# Altium schematic sheet Flight_Controller2.SchDoc: Sensorless BLDC Controller
size A3; PageSetup: Record=PageOptions|CenterHorizontal=True|CenterVertical=True|PrintScale=0.34|XCorrection=1.00|YCorrection=1.00|PrintKind=1|BorderSize=5000000|LeftOffset=0|BottomOffset=0|Orientation=2|PaperLength=1000|PaperWidth=1000|Scale=100|PaperSource=7|PrintQuality=-3|MediaType=1|DitherType=10|PrintScaleMode=1|PaperKind=A3|PaperIndex=8
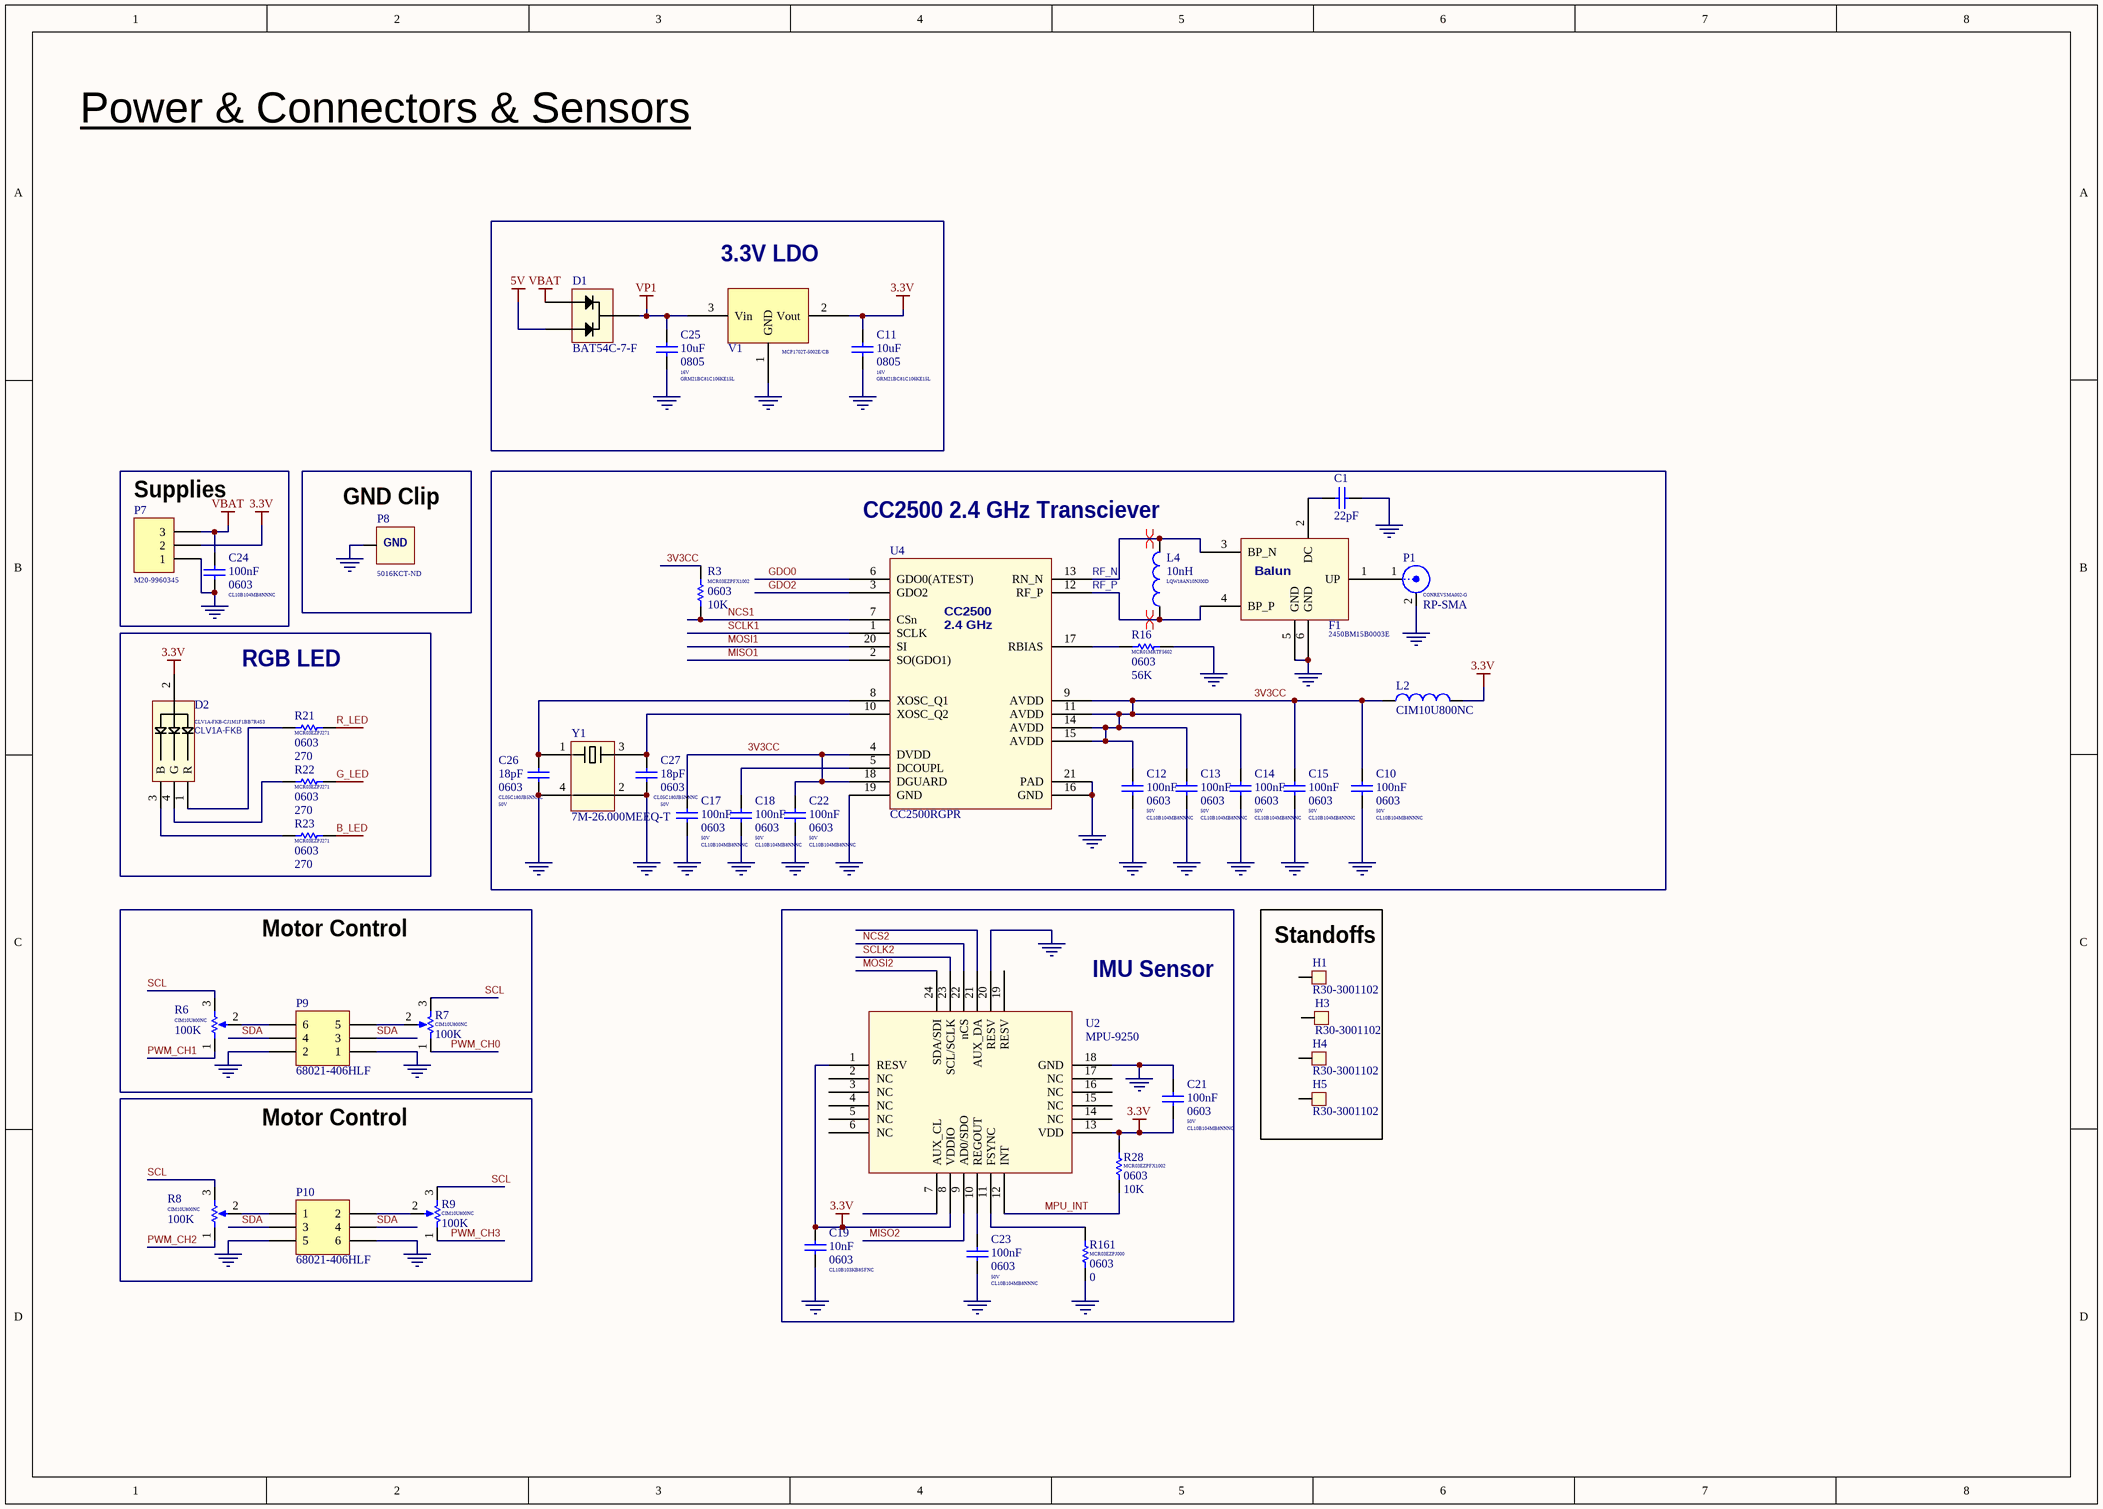
[diagram p0: Flight_Controller2.SchDoc]

## Parts
C1  value 22pF  [1608[0603]C]  (hidden comment: GRM1885C1H220FA01D)
C10  CL10B104MB8NNNC  value 100nF  PackageReference: 0603  Voltage: 50V  [1608[0603]C]
C11  GRM21BC81C106KE15L  value 10uF  PackageReference: 0805  Voltage: 16V  [6-0805_MC]
C12  CL10B104MB8NNNC  value 100nF  PackageReference: 0603  Voltage: 50V  [1608[0603]C]
C13  CL10B104MB8NNNC  value 100nF  PackageReference: 0603  Voltage: 50V  [1608[0603]C]
C14  CL10B104MB8NNNC  value 100nF  PackageReference: 0603  Voltage: 50V  [1608[0603]C]
C15  CL10B104MB8NNNC  value 100nF  PackageReference: 0603  Voltage: 50V  [1608[0603]C]
C17  CL10B104MB8NNNC  value 100nF  PackageReference: 0603  Voltage: 50V  [1608[0603]C]
C18  CL10B104MB8NNNC  value 100nF  PackageReference: 0603  Voltage: 50V  [1608[0603]C]
C19  CL10B103KB8SFNC  value 10nF  PackageReference: 0603  [1608[0603]C]
C21  CL10B104MB8NNNC  value 100nF  PackageReference: 0603  Voltage: 50V  [1608[0603]C]
C22  CL10B104MB8NNNC  value 100nF  PackageReference: 0603  Voltage: 50V  [1608[0603]C]
C23  CL10B104MB8NNNC  value 100nF  PackageReference: 0603  Voltage: 50V  [1608[0603]C]
C24  CL10B104MB8NNNC  value 100nF  PackageReference: 0603  [1608[0603]C]
C25  GRM21BC81C106KE15L  value 10uF  PackageReference: 0805  Voltage: 16V  [6-0805_MC]
C26  CL05C180JB5NNNC  value 18pF  PackageReference: 0603  Voltage: 50V  [1608[0603]C]
C27  CL05C180JB5NNNC  value 18pF  PackageReference: 0603  Voltage: 50V  [1608[0603]C]
D1  BAT54C-7-F  [SOT-23B_M_3D]
D2  CLV1A-FKB-CJ1M1F1BB7R4S3  [CLV1A-FKB_RGB_3D]
F1  2450BM15B0003E  [Balun]
H1  R30-3001102  [M3_Standoff_3]
H3  R30-3001102  [M3_Standoff_3]
H4  R30-3001102  [M3_Standoff_3]
H5  R30-3001102  [M3_Standoff_3]
L2  CIM10U800NC  [1608[0603]L]
L4  LQW18AN10NJ00D  value 10nH  [1608[0603]L]
P1  CONREVSMA002-G  SMA: RP-SMA  [SMA1]
P7  M20-9960345  [HDR1X3]
P8  5016KCT-ND  [GND_CLIP3]
P9  68021-406HLF  [HDR2X3_3D2]
P10  68021-406HLF  [HDR2X3_3D2]
R3  MCR03EZPFX1002  value 10K  PackageReference: 0603  [1608[0603]R]
R6  CIM10U800NC  value 100K  [1608[0603]TRI]
R7  CIM10U800NC  value 100K  [1608[0603]TRI]
R8  CIM10U800NC  value 100K  [1608[0603]TRI]
R9  CIM10U800NC  value 100K  [1608[0603]TRI]
R16  MCR01MRTF5602  value 56K  PackageReference: 0603  [1608[0603]R]
R21  MCR03EZPJ271  value 270  PackageReference: 0603  [1608[0603]R]
R22  MCR03EZPJ271  value 270  PackageReference: 0603  [1608[0603]R]
R23  MCR03EZPJ271  value 270  PackageReference: 0603  [1608[0603]R]
R28  MCR03EZPFX1002  value 10K  PackageReference: 0603  [1608[0603]R]
R161  MCR03EZPJ000  value 0  PackageReference: 0603  [1608[0603]R]
U2  MPU-9250  [QFN-24/3MM]
U4  CC2500RGPR  [QFN50P400X400-20VM]
V1  MCP1702T-5002E/CB  [SOT-23B_M_3D]
Y1  7M-26.000MEEQ-T  [3225_Crystal]

## Blocks framed on the sheet
3.3V LDO: C11 C25 D1 V1
Supplies: C24 P7
GND Clip: P8
CC2500 2.4 GHz Transciever: C1 C10 C12-C15 C17 C18 C22 C26 C27 F1 L2 L4 P1 R3 R16 U4 Y1
RGB LED: D2 R21-R23
Motor Control: P9 R6 R7
IMU Sensor: C19 C21 C23 R28 R161 U2
Standoffs: H1 H3-H5
Motor Control: P10 R8 R9

## Nets
3.3V: C11.2 C19.2 C21.1 D2.2(V+) L2.1 P7.2 R28.2 U2.1(RESV) U2.8(VDDIO) U2.13(VDD) V1.2(Vout)
5V: D1.2
GND: C1.2 C10.1 C11.1 C12.1 C13.1 C14.1 C15.1 C17.1 C18.1 C19.1 C21.2 C22.1 C23.1 C24.1 C25.1 C26.1 C27.1 F1.5(GND) F1.6(GND) P1.2(Y) P7.1 P8.1(GND) P9.1 P9.2 P10.5 P10.6 R16.1 R161.2 U2.18(GND) U2.20(RESV) U4.16(GND) U4.19(GND) U4.21(PAD) V1.1(GND) Y1.2(GND) Y1.4(GND)
VBAT: C24.2 D1.1 P7.3
VP1: C25.2 D1.3 V1.3(Vin)
3V3CC: C10.2 C12.2 C13.2 C14.2 C15.2 C17.2 C22.2 L2.2 R3.2 U4.4(DVDD) U4.9(AVDD) U4.11(AVDD) U4.14(AVDD) U4.15(AVDD) U4.18(DGUARD)
B_LED: R23.2
G_LED: R22.2
GDO0: U4.6(GDO0(ATEST))
GDO2: U4.3(GDO2)
MISO1: U4.2(SO(GDO1))
MISO2: U2.9(AD0/SDO)
MOSI1: U4.20(SI)
MOSI2: U2.24(SDA/SDI)
MPU_INT: R28.1 U2.12(INT)
NCS1: R3.1 U4.7(CSn)
NCS2: U2.22(nCS)
PWM_CH0: R7.1
PWM_CH1: R6.1
PWM_CH2: R8.1
PWM_CH3: R9.1
R_LED: R21.2
RF_N: F1.3(BP_N) L4.1 U4.13(RN_N)
RF_P: F1.4(BP_P) L4.2 U4.12(RF_P)
SCL: R6.3 R7.3 R8.3 R9.3
SCLK1: U4.1(SCLK)
SCLK2: U2.23(SCL/SCLK)
SDA: P9.3 P9.4 P10.3 P10.4
NetC1_1: C1.1 F1.2(DC)
NetC18_2: C18.2 U4.5(DCOUPL)
NetC23_2: C23.2 U2.10(REGOUT)
NetC26_2: C26.2 U4.8(XOSC_Q1) Y1.1(X1)
NetC27_2: C27.2 U4.10(XOSC_Q2) Y1.3(X2)
NetD2_1: D2.1(R) R21.1
NetD2_3: D2.3(B) R23.1
NetD2_4: D2.4(G) R22.1
NetF1_1: F1.1(UP) P1.1(X)
NetP9_5: P9.5 R7.2
NetP9_6: P9.6 R6.2
NetP10_1: P10.1 R8.2
NetP10_2: P10.2 R9.2
NetR16_2: R16.2 U4.17(RBIAS)
NetR161_1: R161.1 U2.11(FSYNC)

Not connected (* = marked no-connect by the designer): H1 1(0); H3 1(0); H4 1(0); H5 1(0); U2 2(NC) 3(NC) 4(NC) 5(NC) 6(NC) 7(AUX_CL) 14(NC) 15(NC) 16(NC) 17(NC) 19(RESV) 21(AUX_DA)

## Layout directives
differential pair: RF_N, RF_P

## Notes on the sheet
- Power & Connectors & Sensors
- (in symbol BALUN_2_4_GHZ) Balun
- (in symbol CC2500_2_4_ghz) CC2500; 2.4 GHz
- (in symbol RGB_LED_SMT) CLV1A-FKB

## Library data of the parts
C1 = Cap Semi: Capacitor (Semiconductor SIM Model); Published: 8-Jun-2000; LatestRevisionDate: 29-May-2009; LatestRevisionNote: IPC-7351 Footprint Added.; PackageReference: C1206; Publisher: Altium Limited; PackageDescription: Chip Capacitor; Digikey: 311-1361-1-ND
C10 C12-C15 C17 C18 C21-C24 = Cap Semi: Capacitor (Semiconductor SIM Model); PP1: 0.01210; Page: PowerInput; PackageDescription: Chip Capacitor; Digikey: 311-1361-1-ND; Part_Number: CL10B104MB8NNNC; PP100: 0.01210
C11 C25 = Cap Semi: Capacitor (Semiconductor SIM Model); Part_Number: CL10B104MB8NNNC; PP1: 0.20000; PP100: 0.06560; Page: Ethernet; PackageDescription: Chip Capacitor; Digikey: 311-1361-1-ND; ClassName: ETH_2; EXT: EXT
C19 = Cap Semi: Capacitor (Semiconductor SIM Model); PP100: 0.00910; Page: Analog; Published: 8-Jun-2000; LatestRevisionDate: 29-May-2009; LatestRevisionNote: IPC-7351 Footprint Added.; Publisher: Altium Limited; PackageDescription: Chip Capacitor; Digikey: 311-1361-1-ND; PP1: 0.00910; ClassName: AI_5
C26 C27 = Cap Semi: Capacitor (Semiconductor SIM Model); PP1: 0.00610; Page: Micro; PackageDescription: Chip Capacitor; Digikey: 311-1361-1-ND; PP100: 0.00610
D1 = Bat45C
D2 = RGB_LED_SMT: SMT RGB LED
F1 = BALUN_2_4_GHZ: 2450BM15B0003; Part Number: 2450BM15B0003
H1 H3-H5 = stand_off: Populate: DNP; Page: PowerInput
L2 = Inductor: PP1: 0.1900; PP100: 0.0620; Page: Micro
L4 = Inductor
P1 = SMB: SMB Straight Connector; Part #: 5-1814832-1
P7 = Header 3: Header, 3-Pin; LatestRevisionDate: 17-Jul-2002; LatestRevisionNote: Re-released for DXP Platform.; Publisher: Altium Limited
P8 = GND_CLIP: PP100: 0.26530; PP1: 0.40000; Page: PowerInput
P9 P10 = Header 3X2: Header, 3-Pin, Dual row; LatestRevisionDate: 17-Jul-2002; LatestRevisionNote: Re-released for DXP Platform.; Publisher: Altium Limited
R3 R16 R28 = Res1: Resistor; Part_Number: MCR03ERTJ102; PP1: 0.10000; PP100: 0.00780; Page: PowerInput
R6-R9 = RPot: Potentiometer; Sim Note: Enter the Resistance value and the set point into parameter fields.; Set Position: 0.5; Published: 8-Jun-2000; LatestRevisionDate: 17-Jul-2002; LatestRevisionNote: Re-released for DXP Platform.; PackageReference: VR5; Publisher: Altium Limited; PackageDescription: Variable Resistor, Thru-Hole; 3 Leads
R21-R23 = Res1: Resistor; Part_Number: MCR03ERTJ102; PP1: 0.10000; PP100: 0.00780; Page: Ethernet; ClassName: ETH_2
R161 = Res1: Resistor; Part_Number: MCR03ERTJ102; PP1: 0.10000; PP100: 0.00620; Page: Analog; ClassName: AI_3
U2 = MPU-9250_LIB
U4 = CC2500_2_4_ghz
V1 = MCP1700: MCP1700 3.3V REG
Y1 = 12MHz_Crystal: 26 MHz Crystal 3225